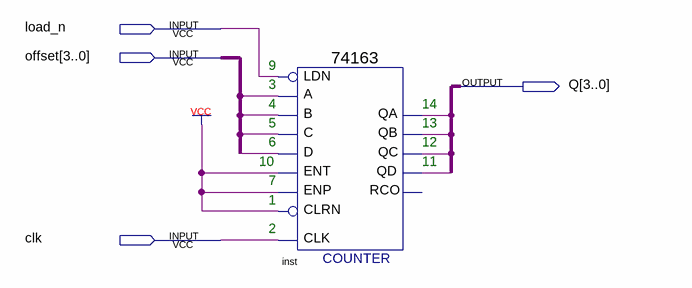
[diagram p0: schematic sheet]
// Quartus schematic unit_fd.bdf as structural Verilog: 1 symbols, 4 pins
module unit_fd (
  input  load_n,
  input  [3:0] offset,
  input  clk,
  output [3:0] Q
);

  \74163  inst (
    .C(offset[2]), .B(offset[1]), .A(offset[0]), .ENT(1'b1), .D(offset[3]), .CLRN(1'b1), .CLK(clk),
    .ENP(1'b1), .LDN(load_n), .QA(Q[0]), .QB(Q[1]), .QC(Q[2]), .QD(Q[3]));  // open: RCO

  // Notes on the sheet:
  //   9
  //   3
  //   4
  //   14
  //   5
  //   13
  //   6
  //   12
  //   10
  //   11
  //   7
  //   1
  //   2
endmodule
